# EAGLE design ardufocus (EAGLE 9.4.0)
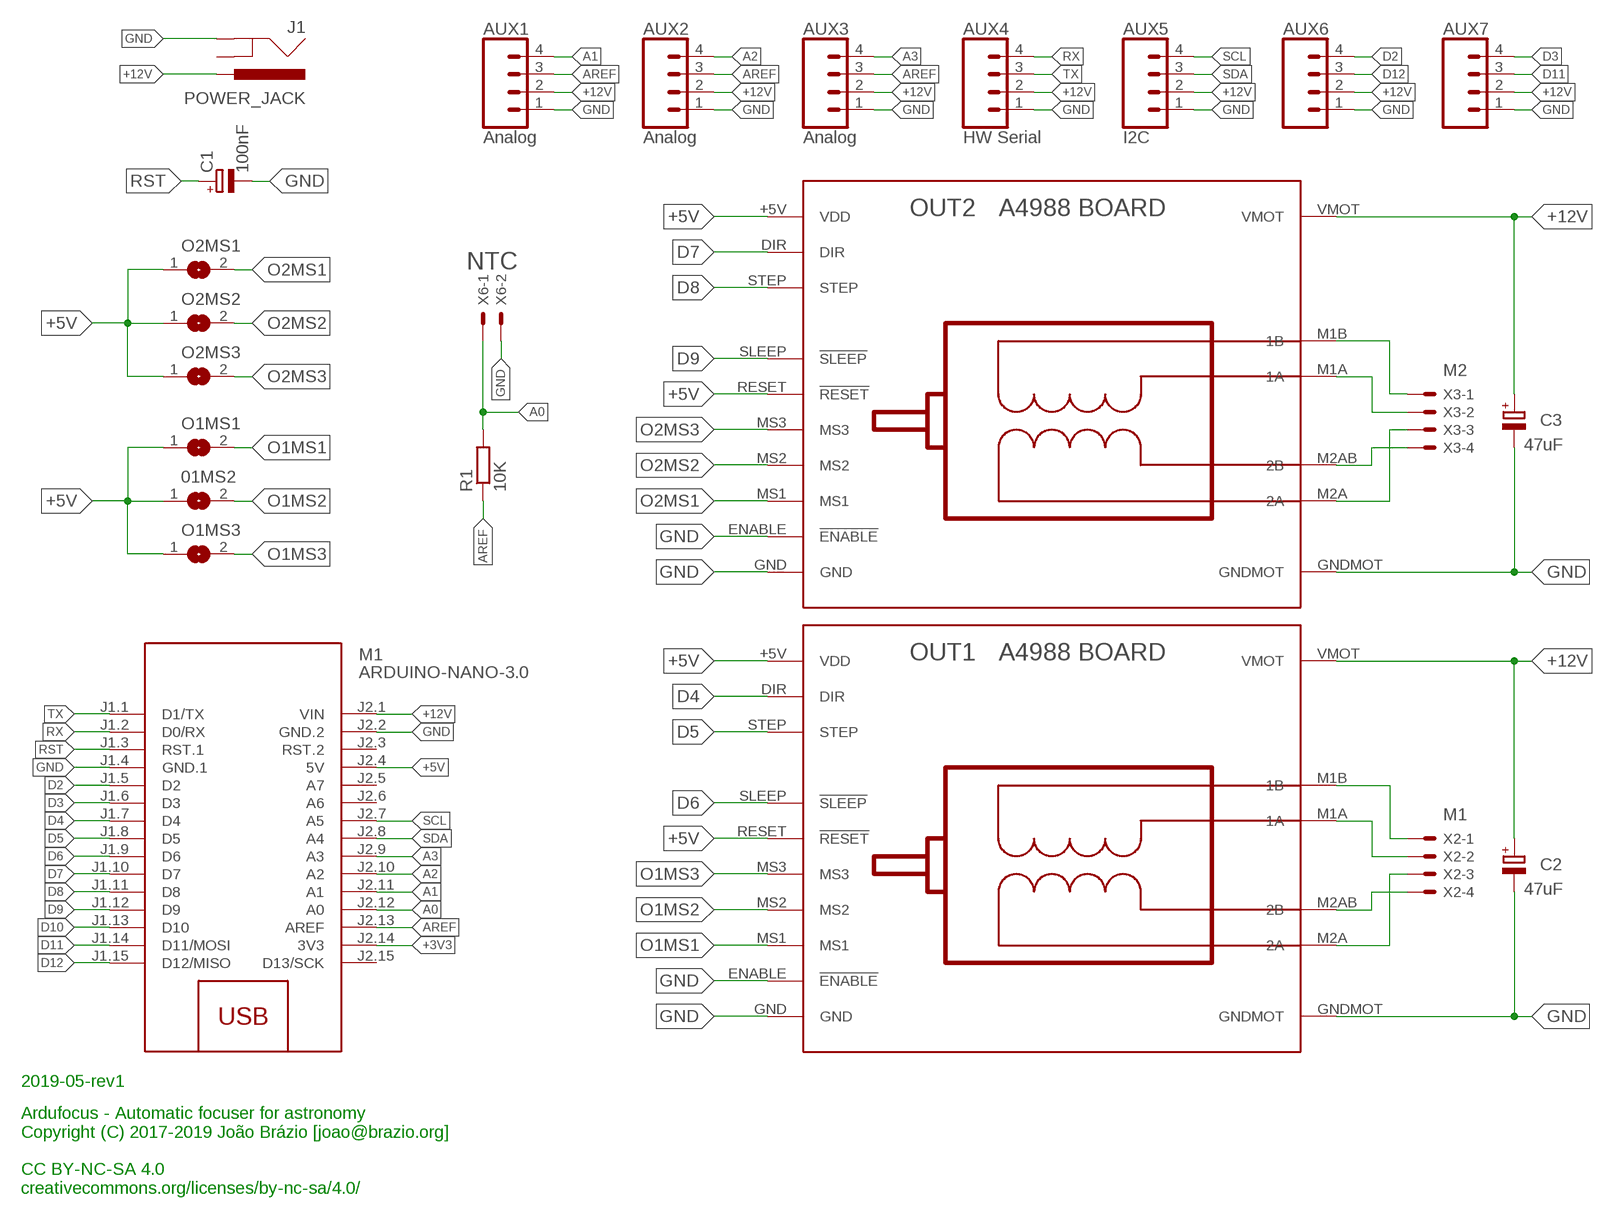
[diagram p0: schematic, sheet 1]

## Parts
01MS2  SJ  [SJ]
AUX1  Analog  CONN_04  [1X04]
AUX2  Analog  CONN_04  [1X04]
AUX3  Analog  CONN_04  [1X04]
AUX4  HW Serial  CONN_04  [1X04]
AUX5  I2C  CONN_04  [1X04]
AUX6  CONN_04  [1X04]
AUX7  CONN_04  [1X04]
C1  100nF  CPOL-EUE2-5  [E2-5]
C2  47uF  CPOL-EUE3.5-8  [E3,5-8]
C3  47uF  CPOL-EUE3.5-8  [E3,5-8]
J1  POWER_JACK  [POWER_JACK_PTH]
M1  ARDUINO-NANO-3.0  [ARDUINO-NANO-3.0]
O1MS1  SJ  [SJ]
O1MS3  SJ  [SJ]
O2MS1  SJ  [SJ]
O2MS2  SJ  [SJ]
O2MS3  SJ  [SJ]
OUT1  BOARD_A4988  [BOARD_A4988]
OUT2  BOARD_A4988  [BOARD_A4988]
R1  10K  R-EU_0207/7  [0207/7]
X2  JST-XH-04-PIN-LONG-PAD  [JST-XH-04-PACKAGE-LONG-PAD]
X3  JST-XH-04-PIN-LONG-PAD  [JST-XH-04-PACKAGE-LONG-PAD]
X6  JST-XH-02-PIN-LONG-PAD  [JST-XH-02-PACKAGE-LONG-PAD]

## Nets
+3V3: M1.J2.14(3V3)
+5V [pwr5]: 01MS2.1 M1.J2.4(5V) O1MS1.1 O1MS3.1 O2MS1.1 O2MS2.1 O2MS3.1 OUT1.+5V(VDD) OUT1.RESET(!RESET) OUT2.+5V(VDD) OUT2.RESET(!RESET)
+12V [pwr12]: AUX1.2 AUX2.2 AUX3.2 AUX4.2 AUX5.2 AUX6.2 AUX7.2 C2.+ C3.+ J1.PWR M1.J2.1(VIN) OUT1.VMOT OUT2.VMOT
A0 [analog]: M1.J2.12(A0) R1.2 X6.1
A1: AUX1.4 M1.J2.11(A1)
A2: AUX2.4 M1.J2.10(A2)
A3: AUX3.4 M1.J2.9(A3)
AREF [analog]: AUX1.3 AUX2.3 AUX3.3 M1.J2.13(AREF) R1.1
D2: AUX6.4 M1.J1.5(D2)
D3: AUX7.4 M1.J1.6(D3)
D4: M1.J1.7(D4) OUT1.DIR
D5: M1.J1.8(D5) OUT1.STEP
D6: M1.J1.9(D6) OUT1.SLEEP(!SLEEP)
D7: M1.J1.10(D7) OUT2.DIR
D8: M1.J1.11(D8) OUT2.STEP
D9: M1.J1.12(D9) OUT2.SLEEP(!SLEEP)
D10: M1.J1.13(D10)
D11: AUX7.3 M1.J1.14(D11/MOSI)
D12: AUX6.3 M1.J1.15(D12/MISO)
GND: AUX1.1 AUX2.1 AUX3.1 AUX4.1 AUX5.1 AUX6.1 AUX7.1 C1.- C2.- C3.- J1.GND M1.J1.4(GND.1) M1.J2.2(GND.2) OUT1.ENABLE(!ENABLE) OUT1.GND OUT1.GNDMOT OUT2.ENABLE(!ENABLE) OUT2.GND OUT2.GNDMOT X6.2
N$1 [motor]: OUT2.M1B(1B) X3.1
N$9 [motor]: OUT1.M2A(2A) X2.3
N$10 [motor]: OUT2.M1A(1A) X3.2
N$12 [motor]: OUT2.M2AB(2B) X3.4
N$13 [motor]: OUT1.M1B(1B) X2.1
N$14 [motor]: OUT1.M1A(1A) X2.2
N$15 [motor]: OUT1.M2AB(2B) X2.4
N$16 [motor]: OUT2.M2A(2A) X3.3
O1MS1: O1MS1.2 OUT1.MS1
O1MS2: 01MS2.2 OUT1.MS2
O1MS3: O1MS3.2 OUT1.MS3
O2MS1: O2MS1.2 OUT2.MS1
O2MS2: O2MS2.2 OUT2.MS2
O2MS3: O2MS3.2 OUT2.MS3
RST: C1.+ M1.J1.3(RST.1)
RX: AUX4.4 M1.J1.2(D0/RX)
SCL: AUX5.4 M1.J2.7(A5)
SDA: AUX5.3 M1.J2.8(A4)
TX: AUX4.3 M1.J1.1(D1/TX)
Unconnected: J1.GNDBREAK M1.J2.3(RST.2) M1.J2.5(A7) M1.J2.6(A6) M1.J2.15(D13/SCK)

## Notes on the sheet
- NTC
- M2
- M1
- 2019-05-rev1
- Ardufocus - Automatic focuser for astronomy
  Copyright (C) 2017-2019 João Brázio [joao@brazio.org]
  
  CC BY-NC-SA 4.0
  creativecommons.org/licenses/by-nc-sa/4.0/

## Library data of the parts
01MS2 O1MS1 O1MS3 O2MS1-O2MS3 = jumper:SJ: SMD solder JUMPER
AUX1-AUX7 = SparkFun-Connectors:CONN_04: Multi connection point. Often used as Generic Header-pin footprint for 0.1 inch spaced/style header connections On any of the 0.1 inch spaced packages, you can populate with these: Break Away Headers - Straight <https://www.sparkfun.com/products/116> (PRT-00116) Break Away Male Headers - Right Angle <https://www.sparkfun.com/products/553> (PRT-00553) Female Headers <https://www.sparkfun.com/products/115> (PRT-00115) Break Away Headers - Machine Pin <https://www.sparkfun.com/products/117> (PRT-00117) Break Away Female Headers - Swiss Machine Pin <https://www.sparkfun.com/products/743> (PRT-00743) For SCREWTERMINALS and SPRING TERMINALS visit here: Screw Terimnals on SparkFun.com <https://www.sparkfun.com/search/results?term=Screw+Terminals> (5mm/3.5mm/2.54mm spacing) This device is also useful as a general connection point to wire up your design to another part of your project. Our various solder wires solder well into these plated through hole pads. Hook-Up Wire - Assortment (Stranded, 22 AWG) <https://www.sparkfun.com/products/11375> (PRT-11375) Hook-Up Wire - Assortment (Solid Core, 22 AWG) <https://www.sparkfun.com/products/11367> (PRT-11367) View the entire wire category on our website here <https://www.sparkfun.com/categories/141> Special notes: Molex polarized connector foot print use with SKU : PRT-08231 with associated crimp pins and housings. 1MM SMD Version SKU: PRT-10208; PROD_ID: CONN-09696
C1-C3 = rcl:CPOL-EU: POLARIZED CAPACITOR, European symbol; SPICEPREFIX: C
J1 = SparkFun-Connectors:POWER_JACK: Power Jack Connector This is the standard 5.5mm barrel jack for power. The PTH is the most common, proven, reliable, footprint. The Slot footprint only works if the mill layer is transmitted to the PCB fab house so be warned. Here are the connectors we sell at SparkFun: DC Barrel Power Jack/Connector <https://www.sparkfun.com/products/119> (PRT-00119) DC Barrel Power Jack/Connector (SMD) <https://www.sparkfun.com/products/12748> (PRT-12748) DC Barrel Jack Adapter - Breadboard Compatible <https://www.sparkfun.com/products/10811> (PRT-10811) It is used on this SparkFun product (and many, many others): SparkFun RedBoard - Programmed with Arduino <https://www.sparkfun.com/products/12757> (DEV-12757) Also, if you need a mating power supply or connector, please check these out: Wall Adapter Power Supply - 9VDC 650mA <https://www.sparkfun.com/products/298> (TOL-00298) DC Barrel Jack Adapter - Male <https://www.sparkfun.com/products/10287> (PRT-10287); PROD_ID: CONN-08197
M1 = diy-modules:ARDUINO-NANO-3.0: Arduino Nano 3.0 and compatible devices More details available here: https://www.arduino.cc/en/Main/ArduinoBoardNano Click here to find device on ebay.com <http://www.ebay.com/sch/arduino+nano>
OUT1 OUT2 = Clean-Kong:BOARD_A4988
R1 = rcl:R-EU_: RESISTOR, European symbol; SPICEPREFIX: R
X2 X3 = jst-xh:JST-XH-04-PIN: JST XH Connector 2 Pin Wire to board connector. Pitch: 2,54 mm, (0.100") Number of pins: 4 Created by Rembrandt Electronics www.rembrandtelectronics.com
X6 = jst-xh:JST-XH-02-PIN: JST XH Connector 2 Pin Wire to board connector. Pitch: 2,54 mm, (0.100") Number of pins: 2 Created by Rembrandt Electronics www.rembrandtelectronics.com

## Net classes
0 default: width 0.254 mm, clearance 0.152 mm
1 pwr5: width 1.143 mm, clearance 0.254 mm
2 pwr12: width 2.286 mm, clearance 0.254 mm
3 motor: width 1.143 mm, clearance 0.254 mm
4 analog: width 0.508 mm, clearance 0.254 mm

## Board
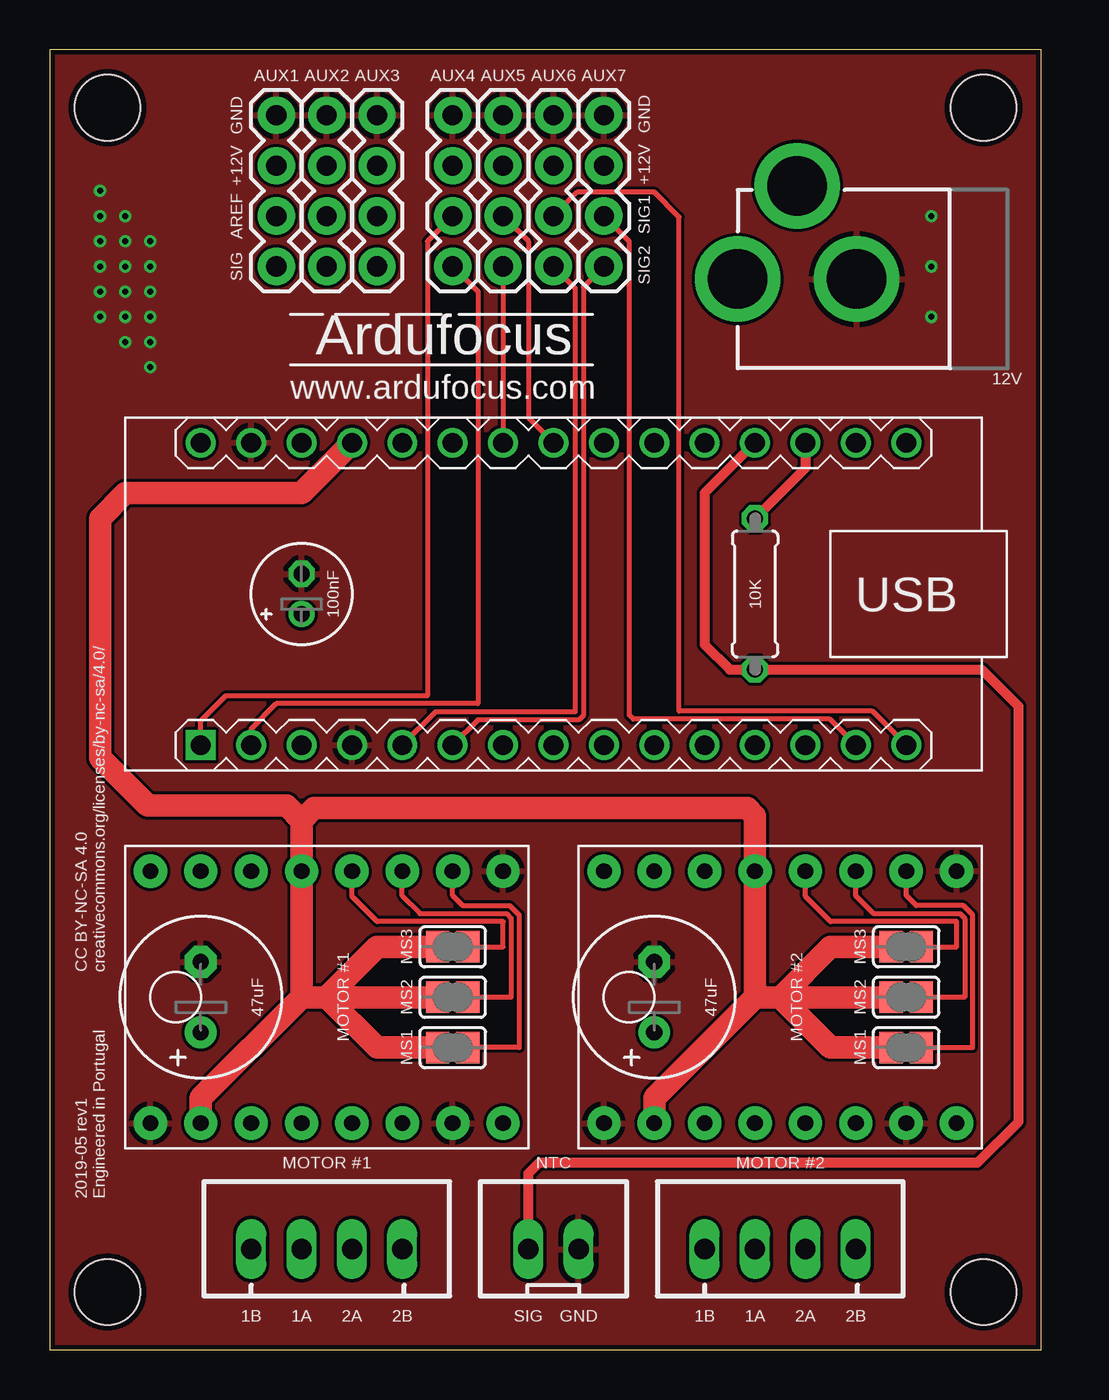
[diagram p1: board, top side]
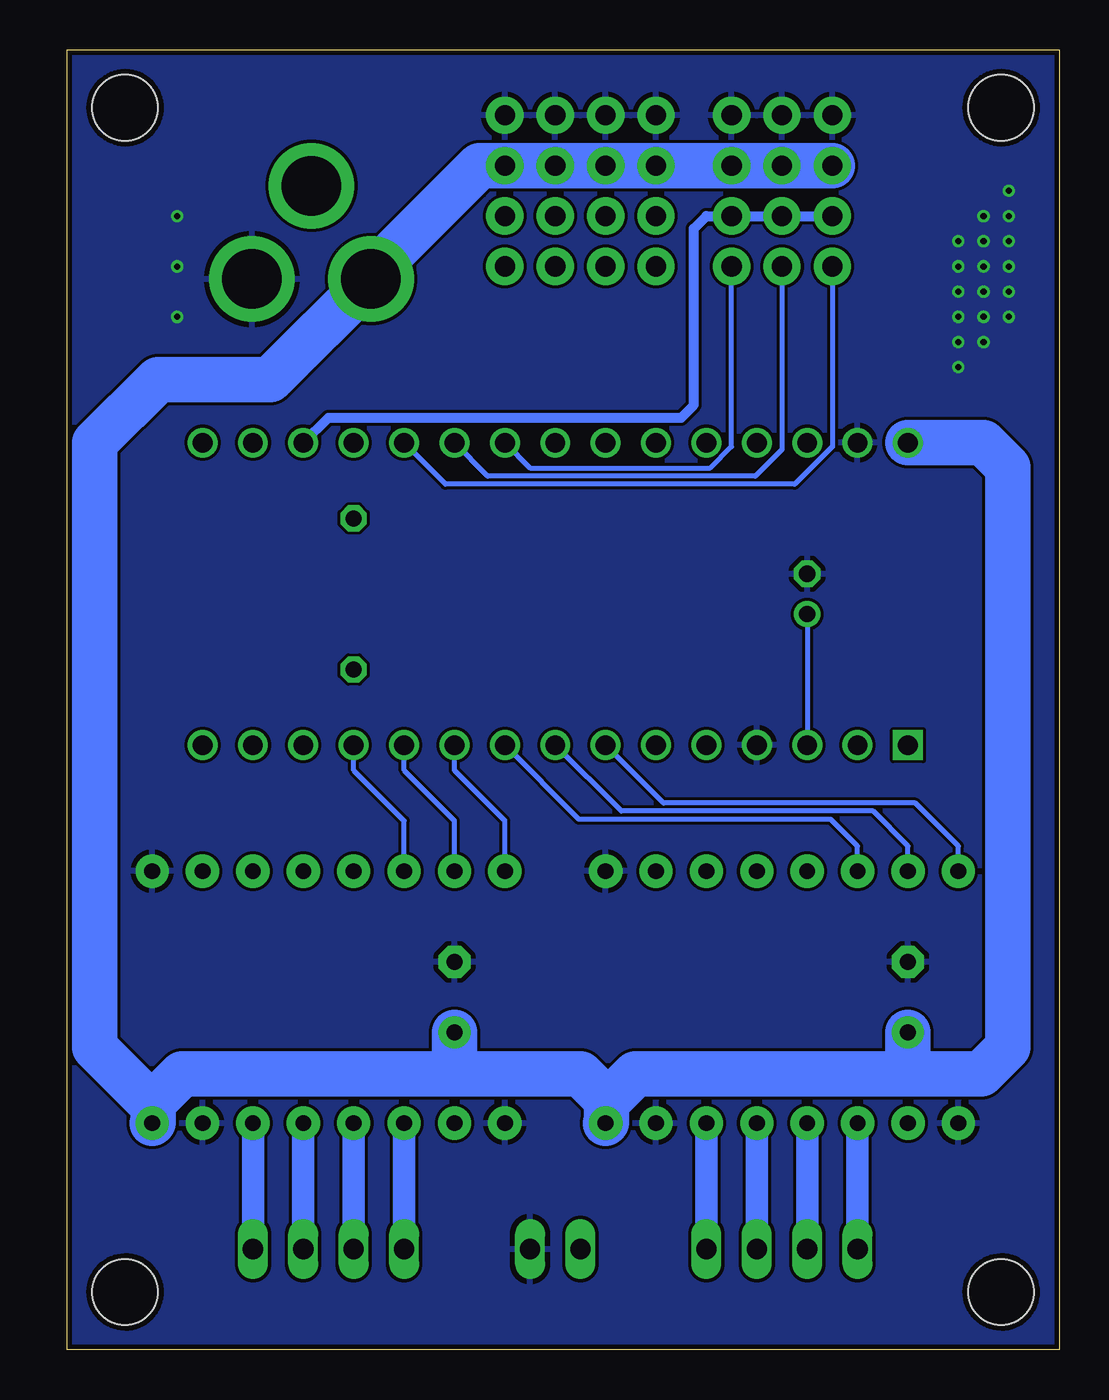
[diagram p2: board, bottom side, seen from below]

Size 50 x 65.54 mm. Coordinates in mm from the lower left corner, seen from the top.
Outline: 0,0 50,0 50,65.54 0,65.54 0,0
Copper layers (1*16): Top 0.035mm / dielectric 1.5mm / Bottom 0.035mm
Design rules "SeeedStudio_2layer_DRU_no_angle_20140221": minimum track width 6mil, minimum drill 12mil, track to track 6mil, track to pad 6mil, pad to pad 6mil, via to via 6mil, smd to smd 0mil, copper to edge 10mil, drill to drill 10mil, minimum pad ring 10mil, minimum via ring 6mil, stop-mask expansion 2mil, vias tented up to drill 100mil, thermal gap 10mil

### Footprints (pad centres in the part's own frame; a part is rotated, then mirrored left to right if it is on the bottom)
SJ = smd 1.168 x 1.6: 1 -0.762,0; 2 0.762,0
1X04 = drill 1.016 pad 1.88: 1 0,0; 2 2.54,0; 3 5.08,0; 4 7.62,0
E2-5 = drill 0.813 pad 1.27: + -1.016,0 | drill 0.813 pad 1.27 octagon: - 1.016,0
E3,5-8 = drill 0.813 pad 1.6: + -1.778,0 | drill 0.813 pad 1.6 octagon: - 1.778,0
POWER_JACK_PTH = drill 2.997 pad 4.318: GND 0,7.7; GNDBREAK 4.7,10.7; PWR 0,13.7
ARDUINO-NANO-3.0 = drill 1 square: J1.1 17.78,7.62 | drill 1: J1.2 15.24,7.62; J1.3 12.7,7.62; J1.4 10.16,7.62; J1.5 7.62,7.62; J1.6 5.08,7.62; J1.7 2.54,7.62; J1.8 0,7.62; J1.9 -2.54,7.62; J1.10 -5.08,7.62; J1.11 -7.62,7.62; J1.12 -10.16,7.62; J1.13 -12.7,7.62; J1.14 -15.24,7.62; J1.15 -17.78,7.62; J2.1 17.78,-7.62; J2.2 15.24,-7.62; J2.3 12.7,-7.62; J2.4 10.16,-7.62; J2.5 7.62,-7.62; J2.6 5.08,-7.62; J2.7 2.54,-7.62; J2.8 0,-7.62; J2.9 -2.54,-7.62; J2.10 -5.08,-7.62; J2.11 -7.62,-7.62; J2.12 -10.16,-7.62; J2.13 -12.7,-7.62; J2.14 -15.24,-7.62; J2.15 -17.78,-7.62
BOARD_A4988 = drill 0.8 pad 1.676: +5V 1.27,16.51; DIR 13.97,19.05; ENABLE 13.97,1.27; GND 1.27,19.05; GNDMOT 1.27,3.81; M1A 1.27,11.43; M1B 1.27,13.97; M2A 1.27,8.89; M2AB 1.27,6.35; MS1 13.97,3.81; MS2 13.97,6.35; MS3 13.97,8.89; RESET 13.97,11.43; SLEEP 13.97,13.97; STEP 13.97,16.51; VMOT 1.27,1.27
0207/7 = drill 0.813 octagon: 1 -3.81,0; 2 3.81,0
STAND-OFF = hole 3.302: 0,0
JST-XH-04-PACKAGE-LONG-PAD = drill 1.016 long: 1 -3.81,0; 2 -1.27,0; 3 1.27,0; 4 3.81,0
JST-XH-02-PACKAGE-LONG-PAD = drill 1.016 long: 1 -1.27,0; 2 1.27,0

### Placement (x,y rotation side)
01MS2  20.32,17.78 0 top
AUX1  11.43,62.23 270 top
AUX2  13.97,62.23 270 top
AUX3  16.51,62.23 270 top
AUX4  20.32,62.23 270 top
AUX5  22.86,62.23 270 top
AUX6  25.4,62.23 270 top
AUX7  27.94,62.23 270 top
C1  12.7,38.1 90 top
C2  7.62,17.78 90 top
C3  30.48,17.78 90 top
J1  48.39,53.98 90 top
M1  25.4,38.1 180 top
O1MS1  20.32,15.24 0 top
O1MS3  20.32,20.32 0 top
O2MS1  43.18,15.24 0 top
O2MS2  43.18,17.78 0 top
O2MS3  43.18,20.32 0 top
OUT1  24.13,10.16 90 top
OUT2  46.99,10.16 90 top
R1  35.56,38.1 270 top
U$1  [STAND-OFF]  2.92,62.61 0 top
U$2  [STAND-OFF]  2.92,2.92 0 top
U$3  [STAND-OFF]  47.08,62.61 0 top
U$4  [STAND-OFF]  47.08,2.92 0 top
X2  13.97,5.08 0 top
X3  36.83,5.08 0 top
X6  25.4,5.08 0 top

### Tracks (layer width: path | path; a pad name or v marks a point on that pad's centre or on a via)
+5V
  Top 1.143: 12.7,17.78 OUT1.RESET 12.7,26.67 | 12.7,26.67 11.94,27.43 4.95,27.43 2.54,29.84 2.54,41.91 3.81,43.18 12.7,43.18 M1.J2.4 | 12.7,26.67 13.34,27.3 35.18,27.3 35.56,26.92 OUT2.RESET 35.56,17.78 | 12.7,17.78 7.62,12.7 OUT1.+5V | 35.56,17.78 30.48,12.7 OUT2.+5V | O2MS2.1 36.83,17.78 | 36.83,17.78 35.56,17.78 | 01MS2.1 13.97,17.78 | 13.97,17.78 16.51,20.32 O1MS3.1 | 13.97,17.78 16.51,15.24 O1MS1.1 | 13.97,17.78 12.7,17.78 | 36.83,17.78 39.37,15.24 O2MS1.1 | 36.83,17.78 39.37,20.32 O2MS3.1
+12V
  Bottom 2.286: 22.81,12.46 21.35,13.92 7.62,13.92 | 22.81,12.46 22.81,11.48 OUT1.VMOT | 7.62,13.92 3.91,13.92 2.59,15.24 2.59,44.5 3.81,45.72 M1.J2.1 | 45.67,12.46 44.21,13.92 30.48,13.92 | 45.67,12.46 45.67,11.48 OUT2.VMOT | 22.81,12.46 22.81,12.6 24.13,13.92 30.48,13.92 | C3.+ 30.48,13.92 | C2.+ 7.62,13.92 | 45.67,12.46 45.82,12.46 48.6,15.24 48.6,45.72 45.43,48.9 39.77,48.9 J1.PWR 34.69,54.21 29.21,59.69 AUX7.2 AUX6.2 AUX5.2 AUX4.2 AUX3.2 AUX2.2 AUX1.2
A0
  Top 0.508: X6.1 24.13,8.89 24.69,9.45 46.79,9.45 48.84,11.51 48.84,32.44 46.99,34.29 R1.2 34.29,34.29 33.02,35.56 33.02,43.18 M1.J2.12
A1
  Bottom 0.254: M1.J2.11 30.94,43.64 13.32,43.64 11.43,45.53 AUX1.4
A2
  Bottom 0.254: M1.J2.10 28.8,44.04 15.31,44.04 13.97,45.38 AUX2.4
A3
  Bottom 0.254: M1.J2.9 26.67,44.45 17.59,44.45 16.51,45.53 AUX3.4
AREF
  Top 0.508: M1.J2.13 38.1,44.45 R1.1
  Bottom 0.508: M1.J2.13 36.83,46.99 19.05,46.99 18.41,47.62 18.41,56.52 17.78,57.15 AUX3.3 AUX2.3 AUX1.3
D2
  Top 0.254: AUX6.4 26.5,53.51 26.5,32.16 19.46,32.16 M1.J1.5
D3
  Top 0.254: AUX7.4 26.9,53.57 26.9,31.98 26.67,31.75 21.59,31.75 M1.J1.6
D4
  Bottom 0.254: OUT1.DIR 5.08,25.4 7.24,27.56 19.94,27.56 M1.J1.7
D5
  Bottom 0.254: OUT1.STEP 7.62,25.4 9.37,27.15 22.07,27.15 M1.J1.8
D6
  Bottom 0.254: OUT1.SLEEP 10.16,25.4 11.51,26.75 24.21,26.75 M1.J1.9
D7
  Bottom 0.254: OUT2.DIR 27.94,26.67 30.48,29.21 M1.J1.10
D8
  Bottom 0.254: OUT2.STEP 30.48,26.67 33.02,29.21 M1.J1.11
D9
  Bottom 0.254: OUT2.SLEEP 33.02,26.67 35.56,29.21 M1.J1.12
D11
  Top 0.254: AUX7.3 29.23,55.86 29.23,31.98 29.42,31.79 39.33,31.79 M1.J1.14
D12
  Top 0.254: AUX6.3 26.62,58.37 30.46,58.37 31.73,57.1 31.73,32.19 41.47,32.19 M1.J1.15
GND  (via drill 0.3)
  other vias: 2.54,58.42 3.81,57.15 5.08,55.88 5.08,54.61 5.08,53.34 3.81,55.88 2.54,57.15 2.54,55.88 3.81,54.61 3.81,53.34 2.54,54.61 5.08,52.07 5.08,50.8 3.81,52.07 2.54,53.34 2.54,52.07 3.81,50.8 5.08,49.53 44.45,57.15 44.45,54.61 44.45,52.07
  pour Top: -1.27,67.31 50.8,67.31 50.8,-1.27 -1.27,-1.27
  pour Bottom: -2.54,68.58 52.07,68.58 52.07,-2.54 -2.54,-2.54
N$1
  Bottom 1.143: X3.1 OUT2.M1B
N$9
  Bottom 1.143: OUT1.M2A X2.3
N$10
  Bottom 1.143: X3.2 OUT2.M1A
N$12
  Bottom 1.143: X3.4 OUT2.M2AB
N$13
  Bottom 1.143: OUT1.M1B X2.1
N$14
  Bottom 1.143: OUT1.M1A X2.2
N$15
  Bottom 1.143: X2.4 OUT1.M2AB
N$16
  Bottom 1.143: X3.3 OUT2.M2A
O1MS1
  Top 0.254: O1MS1.2 23.67,15.24 23.67,21.93 23.2,22.4 20.83,22.4 20.32,22.91 OUT1.MS1
O1MS2
  Top 0.254: 01MS2.2 23.27,17.78 23.27,21.76 23.03,22 18.67,22 17.78,22.89 OUT1.MS2
O1MS3
  Top 0.254: O1MS3.2 22.86,20.32 22.86,21.59 16.51,21.59 15.24,22.86 OUT1.MS3
O2MS1
  Top 0.254: O2MS1.2 46.53,15.24 46.53,21.93 46.06,22.4 43.69,22.4 43.18,22.91 OUT2.MS1
O2MS2
  Top 0.254: O2MS2.2 46.13,17.78 46.13,21.76 45.89,22 41.53,22 40.64,22.89 OUT2.MS2
O2MS3
  Top 0.254: O2MS3.2 45.72,20.32 45.72,21.59 39.37,21.59 38.1,22.86 OUT2.MS3
RST
  Bottom 0.254: C1.+ M1.J1.3
RX
  Top 0.254: AUX4.4 21.59,53.34 21.59,32.58 11.43,32.58 10.16,31.3 M1.J1.2
SCL
  Top 0.254: AUX5.4 M1.J2.7
SDA
  Top 0.254: AUX5.3 24.13,55.88 24.13,46.99 M1.J2.8
TX
  Top 0.254: AUX4.3 19.05,55.88 19.05,32.98 8.89,32.98 7.62,31.71 M1.J1.1

### Text on the board
tPlace: Ardufocus | www.ardufocus.com | CC BY-NC-SA 4.0 / creativecommons.org/licenses/by-nc-sa/4.0/ | 2019-05 rev1 / Engineered in Portugal
tNames: AUX1 | AUX2 | AUX3 | AUX4 | AUX5 | AUX6 | AUX7 | GND | GND | +12V | +12V | AREF | SIG1 | SIG | SIG2 | 12V | 100nF | 10K | MS3 | MS3 | 47uF | MOTOR #1 | MS2 | 47uF | MOTOR #2 | MS2 | MS1 | MS1 | MOTOR #1 | NTC | MOTOR #2 | 1B | 1A | 2A | 2B | SIG | GND | 1B | 1A | 2A | 2B